# Altium schematic sheet ArcadeRpiSmartShield 33 MCU.SchDoc: MCU and associated circuitry
size A4; DocumentNumber: 1; SheetNumber: 1; SheetTotal: 2; VersionControl_RevNumber: 1
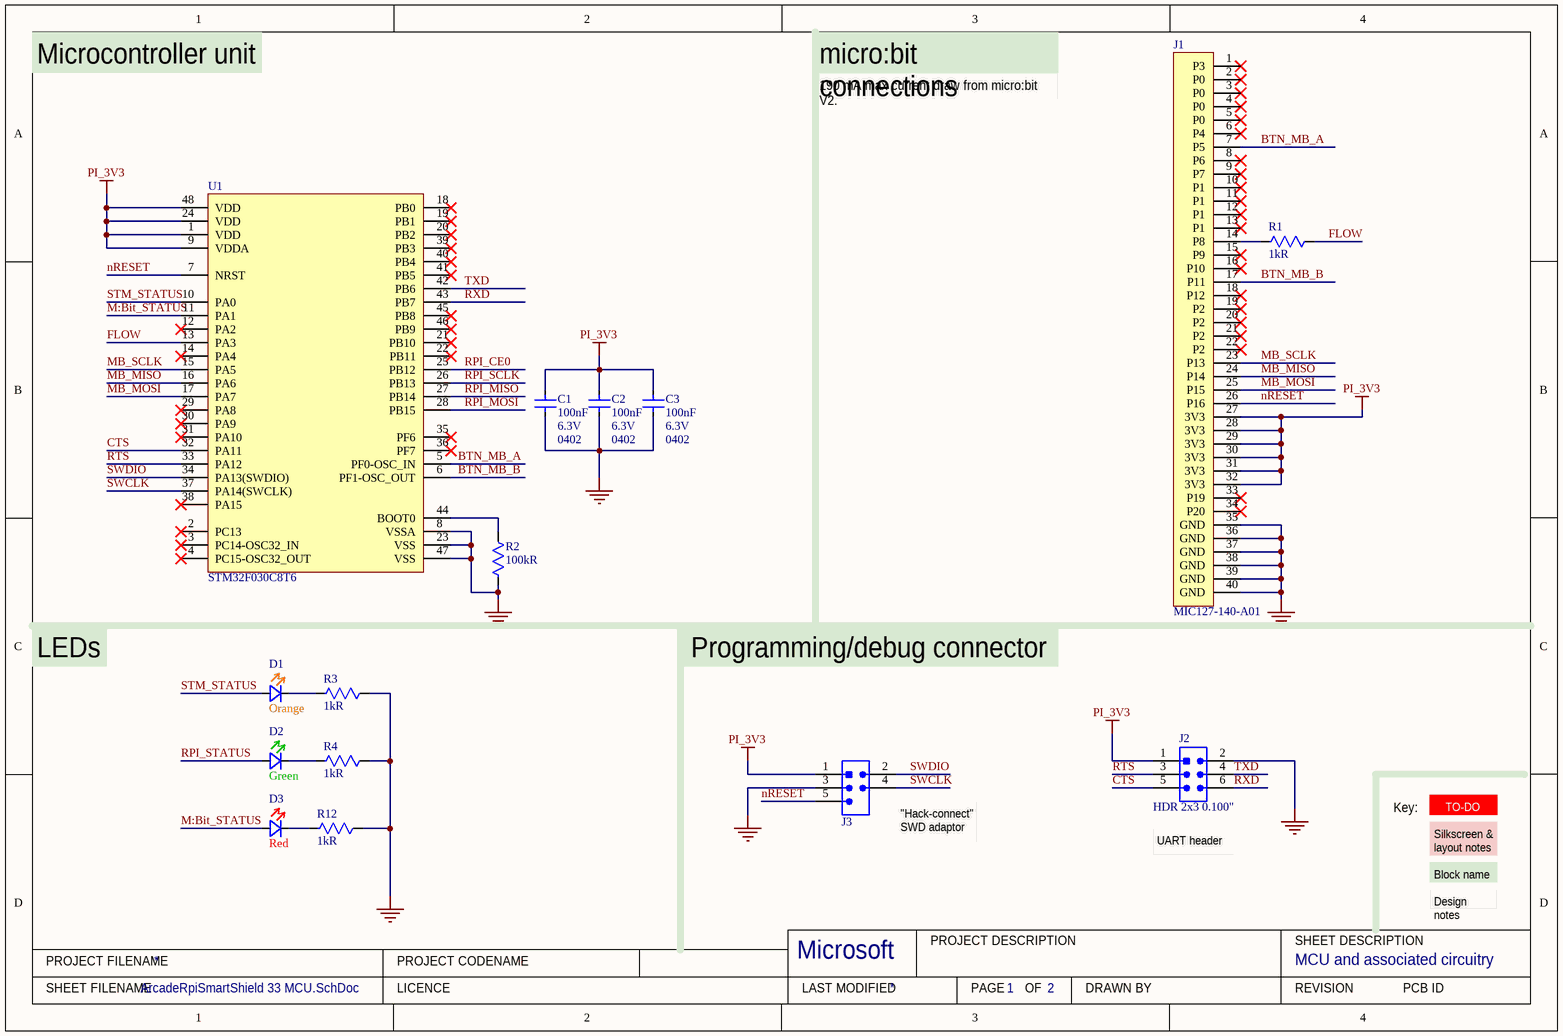
[diagram p0: ArcadeRpiSmartShield 33 MCU.SchDoc]

## Parts
C1  Capacitance: 100nF  Voltage Rating: 6.3V  Case Code (Imperial): 0402  [C0402_0.55MM - without outline]  (hidden comment: CL05B104KQ5NNNC)
C2  Capacitance: 100nF  Voltage Rating: 6.3V  Case Code (Imperial): 0402  [C0402_0.55MM - without outline]  (hidden comment: CL05B104KQ5NNNC)
C3  Capacitance: 100nF  Voltage Rating: 6.3V  Case Code (Imperial): 0402  [C0402_0.55MM - without outline]  (hidden comment: CL05B104KQ5NNNC)
D1  Colour: Orange  [Rohm SML-D12 Orange - without outline]  (hidden comment: SML-D12D)
D2  Colour: Green  [Rohm SML-D12 Green - without outline]  (hidden comment: SML-D12P)
D3  Colour: Red  [Rohm SML-D12 Red - without outline]  (hidden comment: SML-D12U)
J1  Right Angle 1x40p 1.27 mm pitch edge connector for the micro:bit  [MIC127-140-A01]  (value not drawn)
J2  HDR 2x3 0.100"  [PREC003DFAN-RC]
J3  Hack Connect Mini 1.27 mm pitch 2-row  [HACK_CONNECT_MINI_5_X_1_27]  (value not drawn)  (no BOM)
R1  Resistance: 1kR  [R0402 - Without outline]  (hidden comment: RC0402FR-071KL)
R2  Resistance: 100kR  [R0402 - Without outline]  (hidden comment: RC0402FR-07100KL)
R3  Resistance: 1kR  [R0402 - Without outline]  (hidden comment: RC0402FR-071KL)
R4  Resistance: 1kR  [R0402 - Without outline]  (hidden comment: RC0402FR-071KL)
R12  Resistance: 1kR  [R0402 - Without outline]  (hidden comment: RC0402FR-071KL)
U1  STM32F030C8T6  [48-LQFP (7x7)]

## Nets
GND: C1.1 C2.1 C3.1 J1.35(GND) J1.36(GND) J1.37(GND) J1.38(GND) J1.39(GND) J1.40(GND) J2.2(SWDIO) J3.3(GND) R2.1 R3.1 R4.1 R12.1 U1.8(VSSA) U1.23(VSS) U1.47(VSS)
PI_3V3: C1.2 C2.2 C3.2 J1.27(3V3) J1.28(3V3) J1.29(3V3) J1.30(3V3) J1.31(3V3) J1.32(3V3) J2.1(VCC) J3.1(VCC) U1.1(VDD) U1.9(VDDA) U1.24(VDD) U1.48(VDD)
BTN_MB_A: J1.7(P5) U1.5(PF0-OSC_IN)
BTN_MB_B: J1.17(P11) U1.6(PF1-OSC_OUT)
CTS: J2.5(RESET) U1.32(PA11)
FLOW: R1.1 U1.13(PA3)
M:Bit_STATUS: D3.2(A) U1.11(PA1)
MB_MISO: J1.24(P14) U1.16(PA6)
MB_MOSI: J1.25(P15) U1.17(PA7)
MB_SCLK: J1.23(P13) U1.15(PA5)
nRESET: J1.26(P16) J3.5(RESET) U1.7(NRST)
RPI_CE0: U1.25(PB12)
RPI_MISO: U1.27(PB14)
RPI_MOSI: U1.28(PB15)
RPI_SCLK: U1.26(PB13)
RPI_STATUS: D2.2(A)
RTS: J2.3(GND) U1.33(PA12)
RXD: J2.6 U1.43(PB7)
STM_STATUS: D1.2(A) U1.10(PA0)
SWCLK: J3.4(SWCLK) U1.37(PA14(SWCLK))
SWDIO: J3.2(SWDIO) U1.34(PA13(SWDIO))
TXD: J2.4(SWCLK) U1.42(PB6)
NetD1_1: D1.1(K) R3.2
NetD2_1: D2.1(K) R4.2
NetD3_1: D3.1(K) R12.2
NetJ1_14: J1.14(P8) R1.2
NetR2_2: R2.2 U1.44(BOOT0)

Not connected (* = marked no-connect by the designer): J1 1(P3)* 2(P0)* 3(P0)* 4(P0)* 5(P0)* 6(P4)* 8(P6)* 9(P7)* 10(P1)* 11(P1)* 12(P1)* 13(P1)* 15(P9)* 16(P10)* 18(P12)* 19(P2)* 20(P2)* 21(P2)* 22(P2)* 33(P19)* 34(P20)*; U1 2(PC13)* 3(PC14-OSC32_IN)* 4(PC15-OSC32_OUT)* 12(PA2)* 14(PA4)* 18(PB0)* 19(PB1)* 20(PB2)* 21(PB10)* 22(PB11)* 29(PA8)* 30(PA9)* 31(PA10)* 35(PF6)* 36(PF7)* 38(PA15)* 39(PB3)* 40(PB4)* 41(PB5)* 45(PB8)* 46(PB9)*

## Notes on the sheet
- Microcontroller unit
- 190 mA max current draw from micro:bit V2.
- micro:bit connections
- LEDs
- Programming/debug connector
- (near J3) "Hack-connect" SWD adaptor
- (near J2) UART header
- Key:
- TO-DO
- Silkscreen & layout notes
- Block name
- Design notes
- PROJECT FILENAME
- PROJECT CODENAME
- Microsoft
- PROJECT DESCRIPTION
- SHEET DESCRIPTION
- SHEET FILENAME
- LICENCE
- LAST MODIFIED
- PAGE
- OF
- DRAWN BY
- REVISION
- PCB ID

## Library data of the parts
C1-C3 = CL05B104KQ5NNNC: CAP CER 0.1UF 6.3V X7R 0402; Manufacturer: Samsung; Tolerance: 10%; Supplier 1: Digi-Key; Manufacturer Part Number: CL05B104KQ5NNNC; RoHS: Yes; Category: Capacitors; Stock 1: 259020; Pricing 1: 1=0.10000, 10=0.02500, 50=0.01380, 100=0.01130, 500=0.00804, 1000=0.00632, 2500=0.00575, 5000=0.00529 (USD); Mount: Surface Mount; Case/Package: 0402; Case Code (Metric): 1005; Min Operating Temperature: -55°C; Max Operating Temperature: 125°C; Dielectric: X7R; Packaging: Tape and Reel; Voltage Rating (DC): 6.3V; Length: 1mm; Height: 0.5mm; Thickness: 0.022inch; Depth: 0.5mm; Width: 0.02inch; Radiation Hardening: No; Lead Free: Lead Free; ComponentLink1URL: https://datasheet.ciiva.com/25709/cl05b104kq5nnnc-25709268.pdf; ComponentLink1Description: Online datasheet; Supplier 2: Mouser; Stock 2: 20000; Pricing 2: 1=0.10000, 10=0.02800, 100=0.01200, 500=0.00800, 1000=0.00600, 2500=0.00600 (USD); Supplier Part Number 1: 1276-1511-1-ND; Supplier Part Number 2: 187-CL05B104KQ5NNNC; Created By: D. Gakure; Checked By: ?
D1 = SML-D12D: 1.6 x 0.8 x 0.55mm (0603) LED 605nm Orange; Manufacturer: Rohm Semiconductor; Manufacturer Part Number: SML-D12D8WT86; Millicandela Rating: 100mcd; Voltage - Forward (Vf) (Typ): 2.2V; Current - Test: 20mA; Lens Type: Diffused, White; Lens Style/Size: Rectangle with Flat Top, 1.2mm x 0.8mm; Supplier 1: Digi-Key; RoHS: RoHS Compliant; Category: Optoelectronics; Stock 1: 1719; Pricing 1: 1=0.38, 10=0.279, 25=0.2232, 100=0.1478, 250=0.1046, 500=0.08926, 1000=0.06974 (GBP); Packaging: Cut Tape (CT); Wavelength - Dominant: 605nm; Wavelength - Peak: -; Viewing Angle: -; Package / Case: 0603 (1608 Metric); Size / Dimension: 1.60mm L x 0.80mm W; Height: 0.55mm; Mounting Type: Surface Mount; Luminous Flux @ Current - Test: -; ComponentLink1URL: https://d1d2qsbl8m0m72.cloudfront.net/en/products/databook/datasheet/opto/led/chip_mono/sml-d12x8_d13x8-e.pdf; ComponentLink1Description: Online datasheet; Supplier Part Number 1: 511-1577-1-ND
D2 = SML-D12P: 1.6 x 0.8 x 0.55mm (0603) LED 560nm Green; Manufacturer: Rohm Semiconductor; Manufacturer Part Number: SML-D12P8WT86; Millicandela Rating: 6.3mcd; Voltage - Forward (Vf) (Typ): 2.2V; Current - Test: 20mA; Lens Type: Diffused, White; Lens Style/Size: Rectangle with Flat Top, 1.2mm x 0.8mm; Supplier 1: Digi-Key; RoHS: RoHS Compliant; Category: Optoelectronics; Stock 1: 19305; Pricing 1: 1=0.38, 10=0.279, 25=0.2232, 100=0.1478, 250=0.1046, 500=0.08926, 1000=0.06974 (GBP); Packaging: Cut Tape (CT); Wavelength - Dominant: 560nm; Wavelength - Peak: -; Viewing Angle: -; Package / Case: 0603 (1608 Metric); Size / Dimension: 1.60mm L x 0.80mm W; Height: 0.55mm; Mounting Type: Surface Mount; Luminous Flux @ Current - Test: -; ComponentLink1URL: https://d1d2qsbl8m0m72.cloudfront.net/en/products/databook/datasheet/opto/led/chip_mono/sml-d12x8_d13x8-e.pdf; ComponentLink1Description: Online datasheet; Supplier Part Number 1: 511-1579-1-ND
D3 = SML-D12U: 1.6 x 0.8 x 0.55mm (0603) LED 620nm Red; Manufacturer: Rohm Semiconductor; Manufacturer Part Number: SML-D12U8WT86; Millicandela Rating: 63mcd; Voltage - Forward (Vf) (Typ): 2.2V; Current - Test: 20mA; Lens Type: Diffused, White; Lens Style/Size: Rectangle with Flat Top, 1.2mm x 0.8mm; Supplier 1: Digi-Key; RoHS: RoHS Compliant; Category: Optoelectronics; Stock 1: 5722; Pricing 1: 1=0.38, 10=0.279, 25=0.2232, 100=0.1478, 250=0.1046, 500=0.08926, 1000=0.06974 (GBP); Packaging: Cut Tape (CT); Wavelength - Dominant: 620nm; Wavelength - Peak: -; Viewing Angle: -; Package / Case: 0603 (1608 Metric); Size / Dimension: 1.60mm L x 0.80mm W; Height: 0.55mm; Mounting Type: Surface Mount; Luminous Flux @ Current - Test: -; ComponentLink1URL: https://d1d2qsbl8m0m72.cloudfront.net/en/products/databook/datasheet/opto/led/chip_mono/sml-d12x8_d13x8-e.pdf; ComponentLink1Description: Online datasheet; Supplier 2: Farnell; Supplier Part Number 1: 511-1580-1-ND; Supplier Part Number 2: 1685094
J1 = MIC127-140-A01: "Right Angle" 1x40p 1.27mm Dongguan Yuliang BBC micro:bit edge connector; Manufacturer: Dongguan Yuliang; ComponentLink1Description: Yuliang drawing; ComponentLink1URL: http://www.dgyuliang.net/d/file/Produtcs/Customized%20Connector/MICRO%20BIT%20Connector/0d43030af84ade6fc3f00e242079c055.pdf; Manufacturer Part Number: MIC127-140-A01
J2 = PREC003DFAN-RC: CONN HEADER VERT 6POS 2.54MM; Manufacturer: Sullins; Number of Positions: 6; Connector Type: Male Pin; Pitch: 0.1inch; Supplier 1: Digi-Key; Manufacturer Part Number: PREC003DFAN-RC; RoHS: Yes; Category: Connectors; Stock 1: 1243; Pricing 1: 1=0.16000, 10=0.15100, 25=0.12920, 50=0.11280, 100=0.10480, 250=0.09272, 500=0.08870 (USD); Mount: Through Hole; Color: Black; Contact Plating: Tin; Package Quantity: 1; Number of Rows: 2; Packaging: Bulk; Termination: Solder; Contact Type: Male Pin; Row Spacing: 0.1inch; Contact Mating Length: 0.318inch; RoHS Compliant: Yes; ComponentLink1URL: https://datasheet.ciiva.com/741/xrxczzzdxxn-rc-11636-b-741002.pdf; ComponentLink1Description: Online datasheet; Created By: D. Gakure; Checked By: ?; Supplier Part Number 1: S2212EC-03-ND
J3 = HACK_CONNECT_MINI
R1 R3 R4 R12 = RC0402FR-071KL: RES SMD 1K OHM 1% 1/16W 0402; Manufacturer: Yageo; Temperature Coefficient: 100ppm/°C; Voltage Rating (DC): 50V; Power Rating: 62.5mW; Supplier 1: Digi-Key; Manufacturer Part Number: RC0402FR-071KL; RoHS: Yes; Category: Resistors; Stock 1: 37591306; Pricing 1: 1=0.10000, 10=0.01400, 100=0.00580, 1000=0.00262, 2500=0.00228, 5000=0.00188 (USD); Case/Package: 0402; Number of Pins: 2; Case Code (Imperial): 0402; Case Code (Metric): 1005; Min Operating Temperature: -55°C; Max Operating Temperature: 155°C; Resistor Type: Thick Film; Tolerance: 1%; Packaging: Tape and Reel; Voltage Rating: 50V; Termination: SMD/SMT; Length: 1mm; Height: 0.32mm; Width: 0.5mm; Depth: 0.5mm; REACH SVHC: Unknown; Lead Free: Lead Free; Military Standard: Not; ComponentLink2URL: https://datasheet.ciiva.com/12666/pyu-rc0402-51-rohs-l-6-r-12666741.pdf; ComponentLink2Description: Online datasheet; Supplier 2: Mouser; Stock 2: 11912978; Pricing 2: 1=0.10000, 10=0.01200, 100=0.00400, 1000=0.00400, 2500=0.00400, 10000=0.00300 (USD); Supplier 3: Farnell; Stock 3: 29900; Pricing 3: 1=0.08130, 25=0.01210, 100=0.01120, 250=0.01030, 500=0.00900 (GBP); Supplier Part Number 3: 2132441; Supplier Part Number 2: 603-RC0402FR-071KL; Supplier Part Number 1: 311-1.00KLRDKR-ND; Created: D.G; Checked: ?
R2 = RC0402FR-07100KL: RES SMD 100K OHM 1% 1/16W 0402; Manufacturer: Yageo; Temperature Coefficient: 100ppm/°C; Power Rating: 63mW; Voltage Rating: 50V; Supplier 1: Digi-Key; Manufacturer Part Number: RC0402FR-07100KL; RoHS: Yes; Category: Resistors; Stock 1: 5819191; Pricing 1: 1=0.10000, 10=0.01400, 100=0.00580, 1000=0.00262, 2500=0.00228, 5000=0.00188 (USD); Case Code (Metric): 1005; Case Code (Imperial): 0402; Min Operating Temperature: -55°C; Max Operating Temperature: 155°C; Resistor Type: Thick Film; Packaging: Tape and Reel; Package Quantity: 1; Number of Terminations: 2; Termination: SMD/SMT; Max Power Dissipation: 63mW; Working Voltage: 50V; Features: Moisture Resistant; Length: 0.039inch; Height: 0.016inch; Width: 0.02inch; Depth: 0.5mm; REACH SVHC: No SVHC; Lead Free: Lead Free; Military Standard: Not; ComponentLink2URL: https://datasheet.ciiva.com/2453/pyu-r-int-thick-7-2453361.pdf; ComponentLink2Description: Online datasheet; Supplier 2: Mouser; Stock 2: 4458847; Pricing 2: 1=0.10000, 10=0.01200, 100=0.00400, 1000=0.00400, 2500=0.00400, 10000=0.00300 (USD); Supplier 3: Farnell; Stock 3: 19392; Pricing 3: 1=0.10200, 25=0.01220, 100=0.01200, 250=0.01020, 500=0.00890 (GBP); Created By: DG; Checked By: ?; Supplier Part Number 3: 2131798; Supplier Part Number 1: 311-100KLRCT-ND; Supplier Part Number 2: 603-RC0402FR-07100KL; Tolerance: 1%; Case/Package: 0402
U1 = STM32F030C8T6: MCU 32-bit STM32F ARM Cortex M0 RISC 64KB Flash 2.5V/3.3V 48-Pin LQFP Tray; Manufacturer: STMicroelectronics; Max Supply Voltage: 3.6V; Number of I/Os: 39; Interface: I2C,SPI,UART,USART; Frequency: 48MHz; RAM Size: 8KB; Max Power Dissipation: 364mW; Number of Timers/Counters: 7; Min Supply Voltage: 2.4V; Data Bus Width: 32b; Oscillator Type: Internal; Number of ADC Channels: 12; Number of SPI Channels: 2; Number of PWM Channels: 6; Watchdog Timer: Yes; Peripherals: POR,PWM,WDT,DMA; Supplier 1: Digi-Key; RoHS: Yes; Category: Microcontrollers; Pricing 1: 1=2.31000, 10=2.07200, 25=1.95520, 80=1.66575, 250=1.56408, 500=1.36856, 1000=1.30340 (USD); Case/Package: LQFP; Number of Pins: 48; Contact Plating: Tin,Matte; Min Operating Temperature: -40°C; Max Operating Temperature: 85°C; Package Quantity: 250; Packaging: Tray; Number of Programmable I/O: 39; Max Frequency: 48MHz; Number of I2C Channels: 2; Memory Type: FLASH; Memory Size: 64KB; Core Architecture: ARM; Length: 7.2mm; Width: 7.2mm; Height: 1.45mm; Radiation Hardening: No; REACH SVHC: No SVHC; Lead Free: Lead Free; RoHS Compliant: Yes; ComponentLink1URL: https://datasheet.ciiva.com/28647/1792126-28647793.pdf; ComponentLink1Description: Online datasheet; Supplier 2: Avnet; Stock 2: 325; Pricing 2: 1=2.19000, 10=1.88000, 100=1.63000, 500=1.38000, 1000=1.16000, 2500=1.13000 (USD); Supplier Part Number 2: 39X0182; Supplier Part Number 1: 497-14043-ND; Created By: D. Gakure; Checked By: ?; Manufacturer Part Number: STM32F030C8T6